# EAGLE schematic Decoder ROMS (EAGLE 9.6.2)
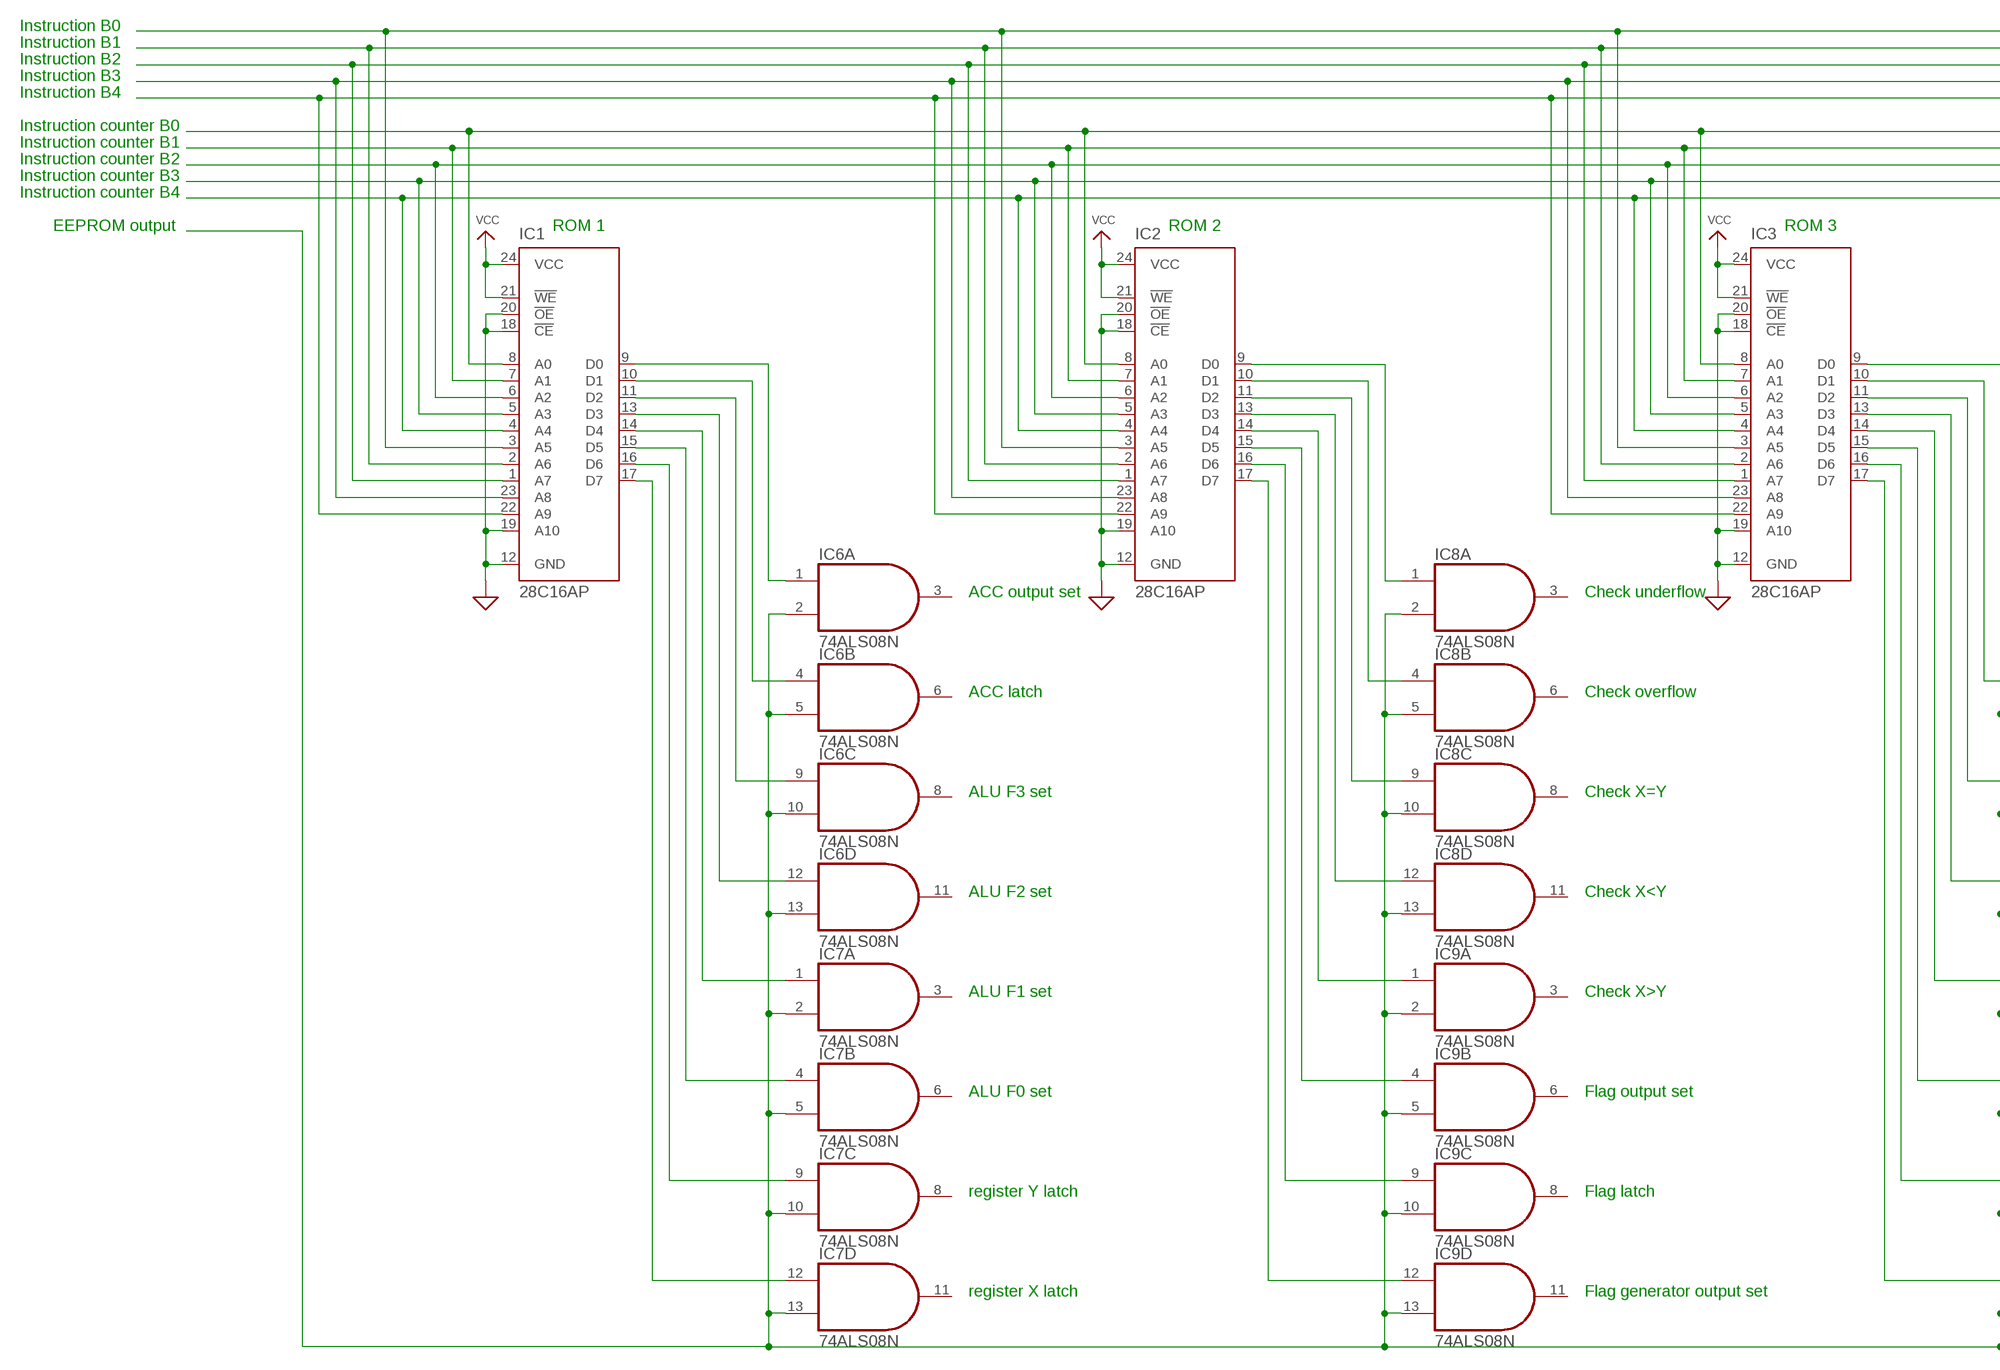
[diagram p0: schematic, sheet 1, part 1 of 2]
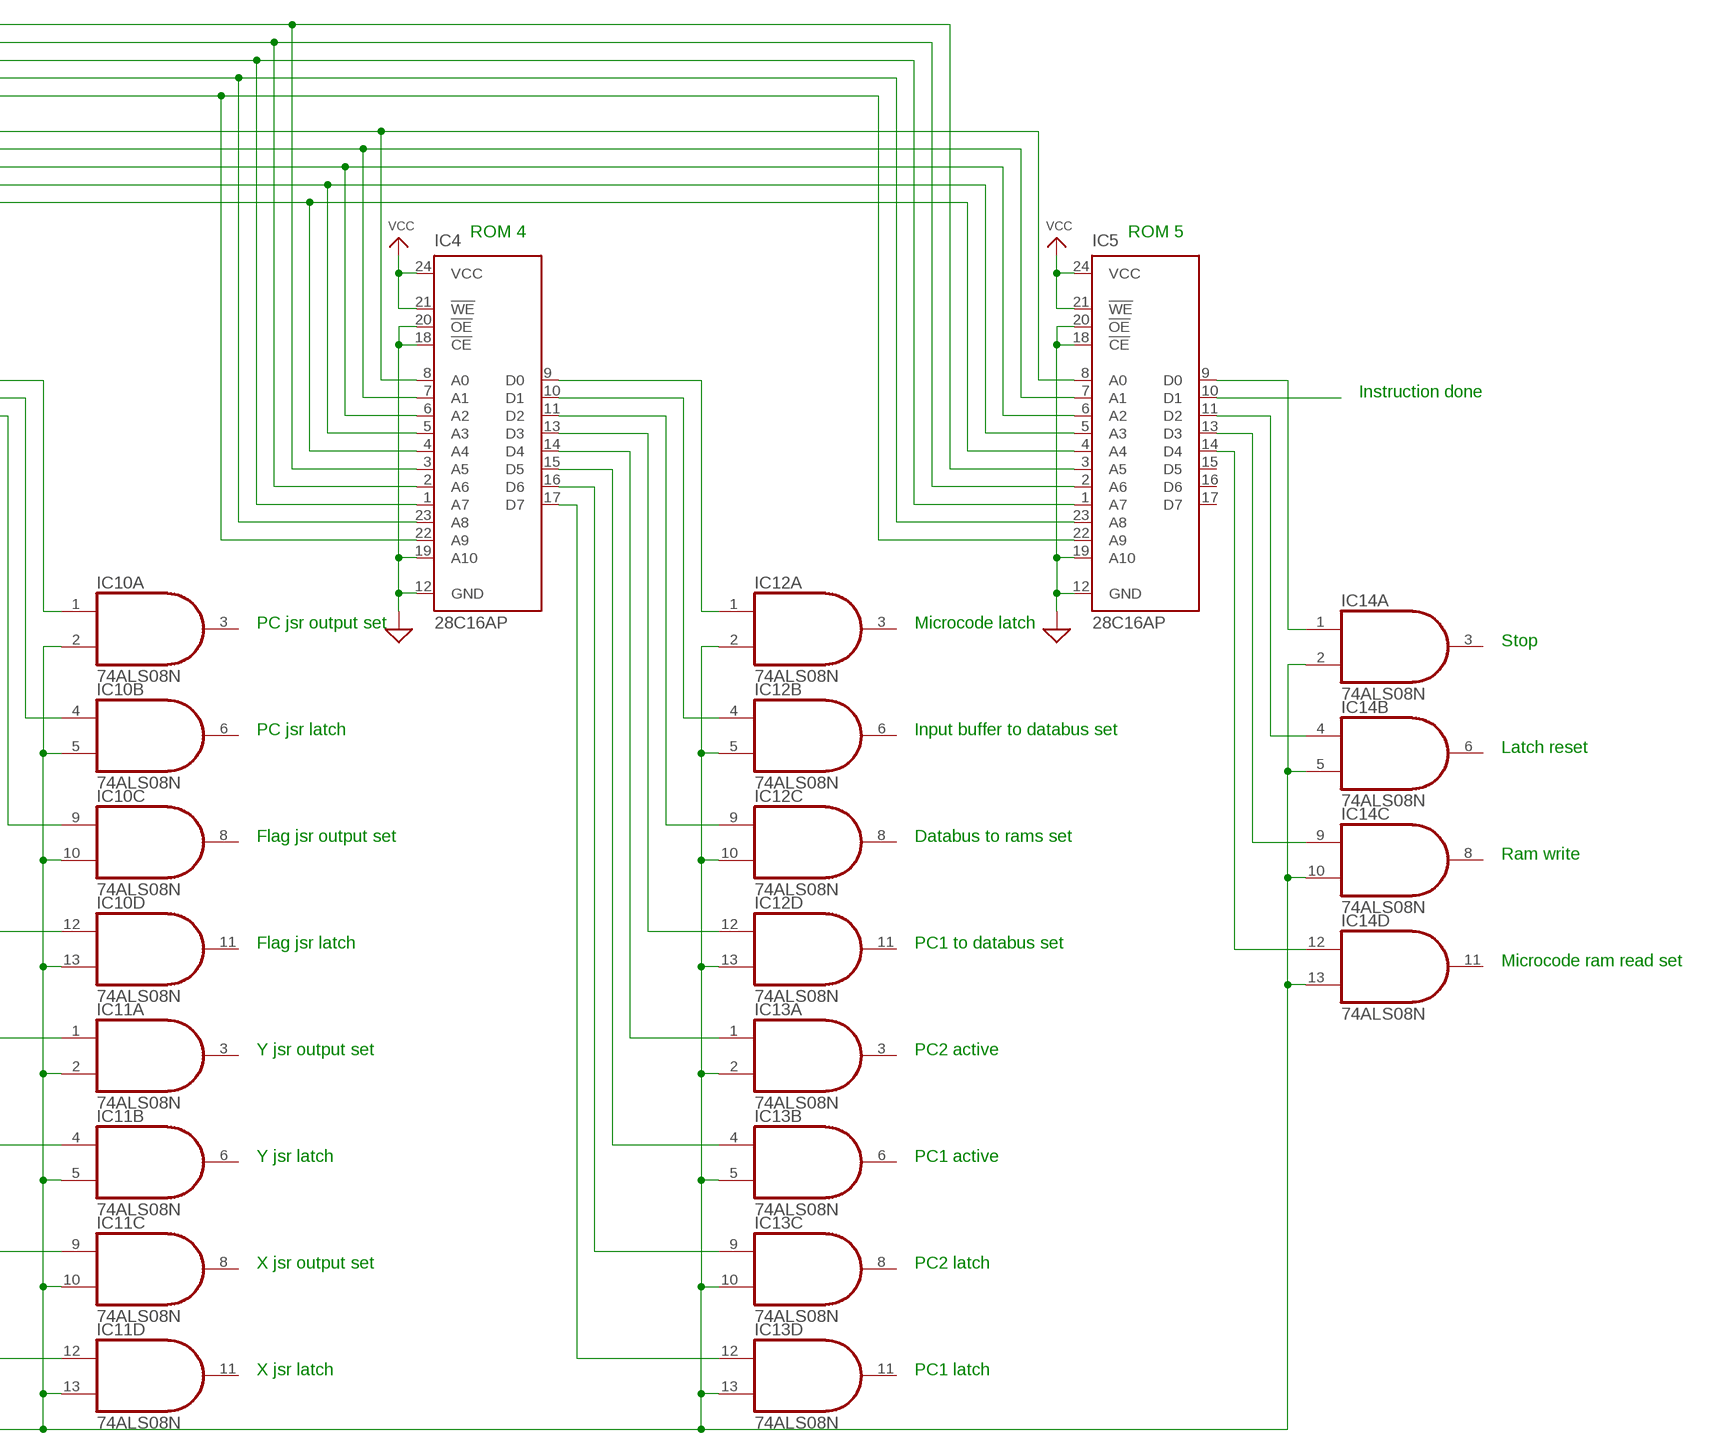
[diagram p1: schematic, sheet 1, part 2 of 2]

## Parts
IC1  28C16AP  [DIL24-6]
IC2  28C16AP  [DIL24-6]
IC3  28C16AP  [DIL24-6]
IC4  28C16AP  [DIL24-6]
IC5  28C16AP  [DIL24-6]
IC6  74ALS08N  [DIL14]
IC7  74ALS08N  [DIL14]
IC8  74ALS08N  [DIL14]
IC9  74ALS08N  [DIL14]
IC10  74ALS08N  [DIL14]
IC11  74ALS08N  [DIL14]
IC12  74ALS08N  [DIL14]
IC13  74ALS08N  [DIL14]
IC14  74ALS08N  [DIL14]

## Nets
GND: IC1.12(GND) IC1.18(!CE) IC1.19(A10) IC1.20(!OE) IC2.12(GND) IC2.18(!CE) IC2.19(A10) IC2.20(!OE) IC3.12(GND) IC3.18(!CE) IC3.19(A10) IC3.20(!OE) IC4.12(GND) IC4.18(!CE) IC4.19(A10) IC4.20(!OE) IC5.12(GND) IC5.18(!CE) IC5.19(A10) IC5.20(!OE) ; supply symbol labelled SUP
N$1: IC1.9(D0) IC6.1(A:I0)
N$2: IC1.10(D1) IC6.4(B:I0)
N$3: IC1.11(D2) IC6.9(C:I0)
N$4: IC1.13(D3) IC6.12(D:I0)
N$5: IC1.14(D4) IC7.1(A:I0)
N$6: IC1.15(D5) IC7.4(B:I0)
N$7: IC1.16(D6) IC7.9(C:I0)
N$8: IC1.17(D7) IC7.12(D:I0)
N$9: IC6.2(A:I1) IC6.5(B:I1) IC6.10(C:I1) IC6.13(D:I1) IC7.2(A:I1) IC7.5(B:I1) IC7.10(C:I1) IC7.13(D:I1) IC8.2(A:I1) IC8.5(B:I1) IC8.10(C:I1) IC8.13(D:I1) IC9.2(A:I1) IC9.5(B:I1) IC9.10(C:I1) IC9.13(D:I1) IC10.2(A:I1) IC10.5(B:I1) IC10.10(C:I1) IC10.13(D:I1) IC11.2(A:I1) IC11.5(B:I1) IC11.10(C:I1) IC11.13(D:I1) IC12.2(A:I1) IC12.5(B:I1) IC12.10(C:I1) IC12.13(D:I1) IC13.2(A:I1) IC13.5(B:I1) IC13.10(C:I1) IC13.13(D:I1) IC14.2(A:I1) IC14.5(B:I1) IC14.10(C:I1) IC14.13(D:I1)
N$10: IC2.9(D0) IC8.1(A:I0)
N$11: IC2.10(D1) IC8.4(B:I0)
N$12: IC2.11(D2) IC8.9(C:I0)
N$13: IC2.13(D3) IC8.12(D:I0)
N$14: IC2.14(D4) IC9.1(A:I0)
N$15: IC2.15(D5) IC9.4(B:I0)
N$16: IC2.16(D6) IC9.9(C:I0)
N$17: IC2.17(D7) IC9.12(D:I0)
N$18: IC1.4(A4) IC2.4(A4) IC3.4(A4) IC4.4(A4) IC5.4(A4)
N$19: IC3.16(D6) IC11.9(C:I0)
N$20: IC3.17(D7) IC11.12(D:I0)
N$21: IC3.9(D0) IC10.1(A:I0)
N$22: IC3.10(D1) IC10.4(B:I0)
N$23: IC3.11(D2) IC10.9(C:I0)
N$24: IC3.13(D3) IC10.12(D:I0)
N$25: IC3.14(D4) IC11.1(A:I0)
N$26: IC3.15(D5) IC11.4(B:I0)
N$27: IC1.5(A3) IC2.5(A3) IC3.5(A3) IC4.5(A3) IC5.5(A3)
N$28: IC4.9(D0) IC12.1(A:I0)
N$29: IC4.10(D1) IC12.4(B:I0)
N$30: IC4.11(D2) IC12.9(C:I0)
N$31: IC4.13(D3) IC12.12(D:I0)
N$32: IC4.14(D4) IC13.1(A:I0)
N$33: IC4.15(D5) IC13.4(B:I0)
N$34: IC4.16(D6) IC13.9(C:I0)
N$35: IC4.17(D7) IC13.12(D:I0)
N$36: IC1.6(A2) IC2.6(A2) IC3.6(A2) IC4.6(A2) IC5.6(A2)
N$37: IC1.7(A1) IC2.7(A1) IC3.7(A1) IC4.7(A1) IC5.7(A1)
N$38: IC1.8(A0) IC2.8(A0) IC3.8(A0) IC4.8(A0) IC5.8(A0)
N$39: IC1.2(A6) IC2.2(A6) IC3.2(A6) IC4.2(A6) IC5.2(A6)
N$40: IC5.9(D0) IC14.1(A:I0)
N$41: IC5.11(D2) IC14.4(B:I0)
N$42: IC5.13(D3) IC14.9(C:I0)
N$43: IC5.14(D4) IC14.12(D:I0)
N$44: IC5.10(D1)
N$45: IC1.3(A5) IC2.3(A5) IC3.3(A5) IC4.3(A5) IC5.3(A5)
N$58: IC1.22(A9) IC2.22(A9) IC3.22(A9) IC4.22(A9) IC5.22(A9)
N$59: IC1.23(A8) IC2.23(A8) IC3.23(A8) IC4.23(A8) IC5.23(A8)
N$60: IC1.1(A7) IC2.1(A7) IC3.1(A7) IC4.1(A7) IC5.1(A7)
VCC: IC1.21(!WE) IC1.24(VCC) IC2.21(!WE) IC2.24(VCC) IC3.21(!WE) IC3.24(VCC) IC4.21(!WE) IC4.24(VCC) IC5.21(!WE) IC5.24(VCC)
Unconnected: IC5.15(D5) IC5.16(D6) IC5.17(D7) IC6.3(A:O) IC6.6(B:O) IC6.8(C:O) IC6.11(D:O) IC7.3(A:O) IC7.6(B:O) IC7.8(C:O) IC7.11(D:O) IC8.3(A:O) IC8.6(B:O) IC8.8(C:O) IC8.11(D:O) IC9.3(A:O) IC9.6(B:O) IC9.8(C:O) IC9.11(D:O) IC10.3(A:O) IC10.6(B:O) IC10.8(C:O) IC10.11(D:O) IC11.3(A:O) IC11.6(B:O) IC11.8(C:O) IC11.11(D:O) IC12.3(A:O) IC12.6(B:O) IC12.8(C:O) IC12.11(D:O) IC13.3(A:O) IC13.6(B:O) IC13.8(C:O) IC13.11(D:O) IC14.3(A:O) IC14.6(B:O) IC14.8(C:O) IC14.11(D:O)

## Notes on the sheet
- Instruction B0
- Instruction B1
- Instruction B2
- Instruction B3
- Instruction B4
- Instruction counter B0
- Instruction counter B1
- Instruction counter B2
- Instruction counter B3
- Instruction counter B4
- EEPROM output | ROM 1 | ROM 2 | ROM 3 | ROM 4 | ROM 5
- Instruction done
- ACC output set | Check underflow | PC jsr output set | Microcode latch
- Stop
- ACC latch | Check overflow | PC jsr latch | Input buffer to databus set
- Latch reset
- ALU F3 set | Check X=Y | Flag jsr output set | Databus to rams set
- Ram write
- ALU F2 set | Check X<Y | Flag jsr latch | PC1 to databus set
- Microcode ram read set
- ALU F1 set | Check X>Y | Y jsr output set | PC2 active
- ALU F0 set | Flag output set | Y jsr latch | PC1 active
- register Y latch | Flag latch | X jsr output set | PC2 latch
- register X latch | Flag generator output set | X jsr latch | PC1 latch

## Power pins joined to a net without a drawn wire
GND: IC6.7(P:GND) IC7.7(P:GND) IC8.7(P:GND) IC9.7(P:GND) IC10.7(P:GND) IC11.7(P:GND) IC12.7(P:GND) IC13.7(P:GND) IC14.7(P:GND)
VCC: IC6.14(P:VCC) IC7.14(P:VCC) IC8.14(P:VCC) IC9.14(P:VCC) IC10.14(P:VCC) IC11.14(P:VCC) IC12.14(P:VCC) IC13.14(P:VCC) IC14.14(P:VCC)

## Library data of the parts
IC1-IC5 = microchip:28*16A: CMOS EPROM 16 K (2 K x 8) Source: ww1.microchip.com/downloads/en/DeviceDoc/11125J.pdf; MPN: CAT28C16ALI-12; OC_FARNELL: 1718292; OC_NEWARK: 06R0648
IC6-IC14 = 74xx-us:74*08: Quad 2-input AND gate